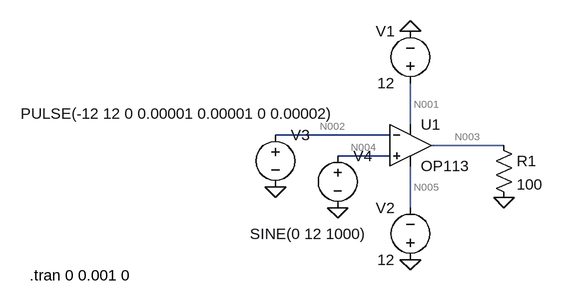
[diagram p0: schematic lab3.asc]
lab3.asc, the LTspice schematic file:
Version 4
SHEET 1 880 680
WIRE 160 112 160 48
WIRE 128 128 -48 128
WIRE 304 144 192 144
WIRE 128 160 48 160
WIRE 160 240 160 176
FLAG 160 320 0
FLAG 160 -32 0
FLAG 48 240 0
FLAG -48 208 0
FLAG 304 224 0
SYMBOL voltage 160 64 R180
WINDOW 0 24 96 Left 2
WINDOW 3 24 16 Left 2
WINDOW 123 0 0 Left 0
WINDOW 39 0 0 Left 0
SYMATTR InstName V1
SYMATTR Value 12
SYMBOL voltage 160 336 R180
WINDOW 0 24 96 Left 2
WINDOW 3 24 16 Left 2
WINDOW 123 0 0 Left 0
WINDOW 39 0 0 Left 0
SYMATTR InstName V2
SYMATTR Value 12
SYMBOL voltage -48 112 R0
WINDOW 3 -392 -17 Left 2
WINDOW 123 0 0 Left 0
WINDOW 39 0 0 Left 0
SYMATTR InstName V3
SYMATTR Value PULSE(-12 12 0 0.00001 0.00001 0 0.00002)
SYMBOL voltage 48 144 R0
WINDOW 3 -135 136 Left 2
WINDOW 123 0 0 Left 0
WINDOW 39 0 0 Left 0
SYMATTR InstName V4
SYMATTR Value SINE(0 12 1000)
SYMBOL res 288 128 R0
SYMATTR InstName R1
SYMATTR Value 100
SYMBOL OpAmps\\OP113 160 80 R0
SYMATTR InstName U1
TEXT -426 344 Left 2 !.tran 0 0.001 0

The netlist it stands for:
* lab3.asc
V1 N001 0 12
V2 0 N005 12
V3 N002 0 PULSE(-12 12 0 0.00001 0.00001 0 0.00002)
V4 N004 0 SINE(0 12 1000)
R1 N003 0 100
XU1 N004 N002 N001 N005 N003 OP113  ; pins In+ In- V+ V- OUT
.tran 0 0.001 0
.lib ADI.lib
.backanno
.end

* Results of the author's LTspice run, read from the files saved beside the schematic
* Operating Point, zero values left out:
*   V(n001) = 12 V
*   V(n005) = -12 V
*   V(n002) = -12 V
*   V(n003) = 4.956 V
*   I(R1) = 49.56 mA
*   I(V1) = -50.17 mA
*   I(V2) = -605.5 µA
*   I(V3) = 1.161 TA
*   I(V4) = -1.161 TA
*   Ix(u1:3) = 1.161 TA
*   Ix(u1:2) = -1.161 TA
*   Ix(u1:7) = 50.17 mA
*   Ix(u1:4) = -605.5 µA
*   Ix(u1:6) = -49.56 mA
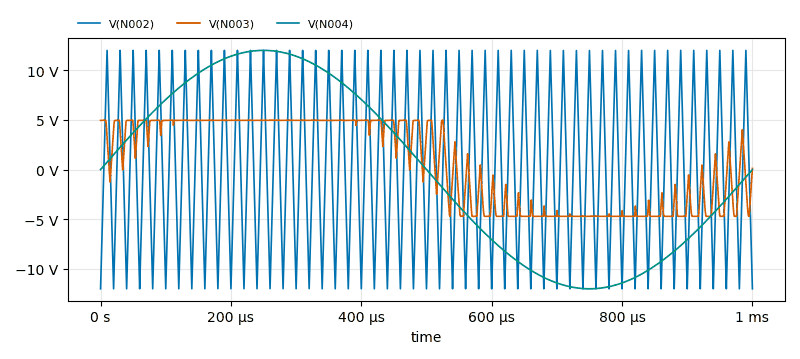
[diagram p1: Transient Analysis of lab3.asc, plotted from the saved traces]
* Transient Analysis, 1 run:
*   V(N002): min -12 V, max 12 V, average -84.36 µV, rms 7.298 V, last -12 V
*   V(N003): min -4.709 V, max 4.976 V, average 603.8 mV, rms 4.435 V, last 117.4 mV
*   V(N004): min -12 V, max 12 V, average 2.948 µV, rms 8.485 V, last 0 V